# Altium schematic sheet DASH_CONNECTORS.SchDoc
size A
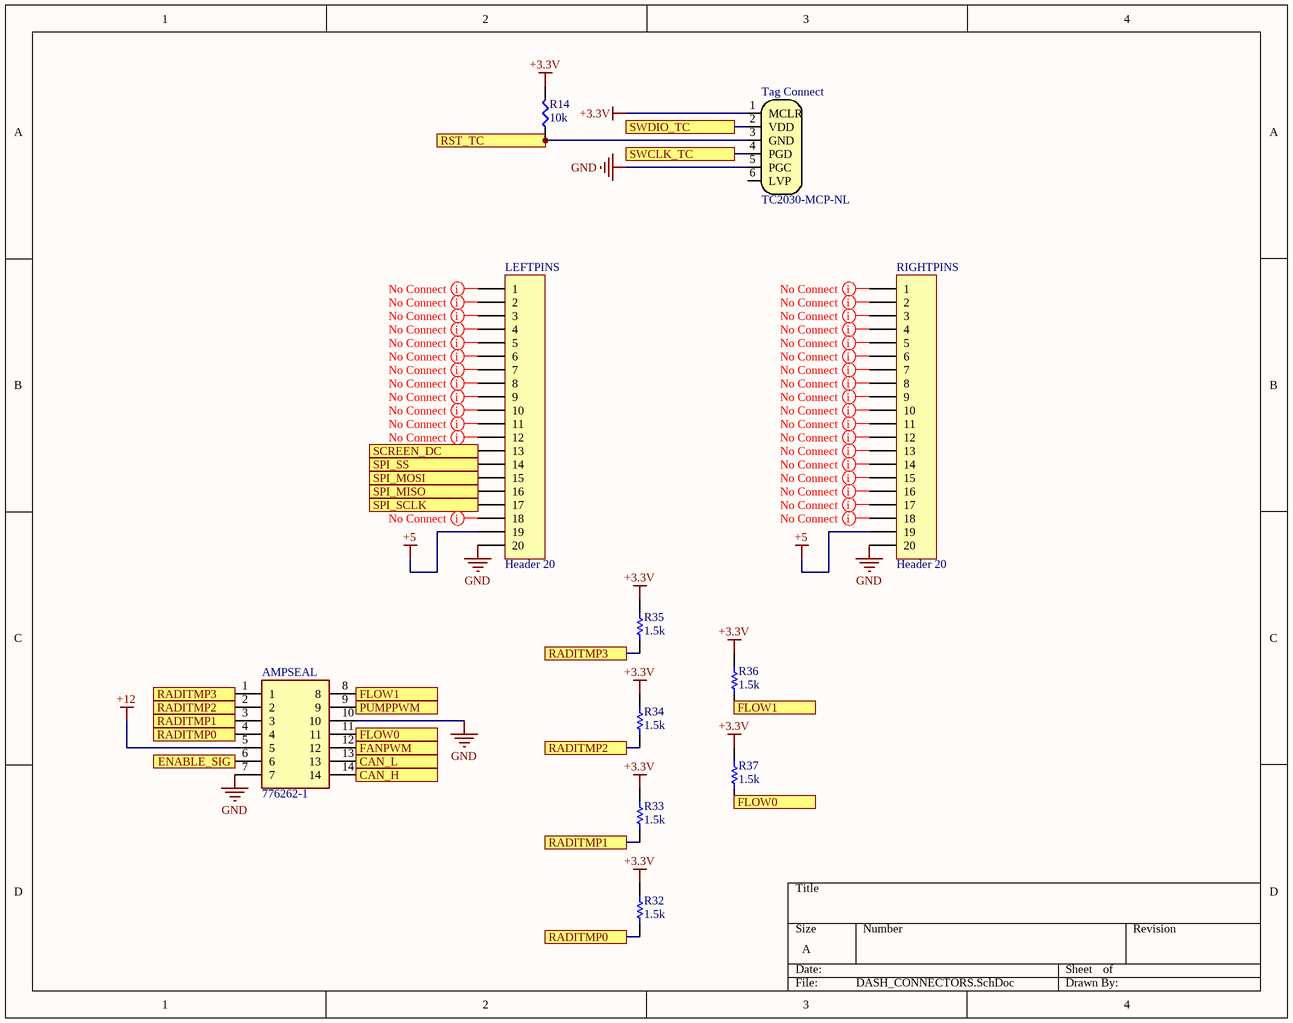
[diagram p0: DASH_CONNECTORS.SchDoc]

## Parts
AMPSEAL  776262-1  [7762621]
LEFTPINS  Header 20  [HDR1X20]
R14  10k  [RES-0603]
R32  1.5k  [RESC1608X55X30ML15T15]
R33  1.5k  [RESC1608X55X30ML15T15]
R34  1.5k  [RESC1608X55X30ML15T15]
R35  1.5k  [RESC1608X55X30ML15T15]
R36  1.5k  [RESC1608X55X30ML15T15]
R37  1.5k  [RESC1608X55X30ML15T15]
RIGHTPINS  Header 20  [HDR1X20]
Tag_Connect  TC2030-MCP-NL  [TC2030-MCP-NL]  (no BOM)

## Ports
CAN_H, CAN_L, ENABLE_SIG, FANPWM, FLOW0, FLOW1, PUMPPWM, RADITMP0, RADITMP1, RADITMP2, RADITMP3, RST_TC, SCREEN_DC, SPI_MISO, SPI_MOSI, SPI_SCLK, SPI_SS, SWCLK_TC, SWDIO_TC

## Nets
+3.3V: R14.2 R32.2 R33.2 R34.2 R35.2 R36.2 R37.2 Tag_Connect.1(MCLR)
+5: LEFTPINS.19 RIGHTPINS.19
+12: AMPSEAL.5
GND: AMPSEAL.7 AMPSEAL.10 LEFTPINS.20 RIGHTPINS.20 Tag_Connect.5(PGC)
CAN_H: AMPSEAL.14 ; port CAN_H
CAN_L: AMPSEAL.13 ; port CAN_L
ENABLE_SIG: AMPSEAL.6 ; port ENABLE_SIG
FANPWM: AMPSEAL.12 ; port FANPWM
FLOW0: AMPSEAL.11 R37.1 ; port FLOW0
FLOW1: AMPSEAL.8 R36.1 ; port FLOW1
PUMPPWM: AMPSEAL.9 ; port PUMPPWM
RADITMP0: AMPSEAL.4 R32.1 ; port RADITMP0
RADITMP1: AMPSEAL.3 R33.1 ; port RADITMP1
RADITMP2: AMPSEAL.2 R34.1 ; port RADITMP2
RADITMP3: AMPSEAL.1 R35.1 ; port RADITMP3
RST_TC: R14.1 Tag_Connect.3(GND) ; port RST_TC
SCREEN_DC: LEFTPINS.13 ; port SCREEN_DC
SPI_MISO: LEFTPINS.16 ; port SPI_MISO
SPI_MOSI: LEFTPINS.15 ; port SPI_MOSI
SPI_SCLK: LEFTPINS.17 ; port SPI_SCLK
SPI_SS: LEFTPINS.14 ; port SPI_SS
SWCLK_TC: Tag_Connect.4(PGD) ; port SWCLK_TC
SWDIO_TC: Tag_Connect.2(VDD) ; port SWDIO_TC

Not connected (* = marked no-connect by the designer): LEFTPINS 1 2 3 4 5 6 7 8 9 10 11 12 18; RIGHTPINS 1 2 3 4 5 6 7 8 9 10 11 12 13 14 15 16 17 18; Tag_Connect 6(LVP)

## Layout directives
mark named No Connect: NetLEFTPINS_1, NetLEFTPINS_2, NetLEFTPINS_3, NetLEFTPINS_4, NetLEFTPINS_5, NetLEFTPINS_6, NetLEFTPINS_7, NetLEFTPINS_8, NetLEFTPINS_9, NetLEFTPINS_10, NetLEFTPINS_11, NetLEFTPINS_12, NetLEFTPINS_18, NetRIGHTPINS_1, NetRIGHTPINS_2, NetRIGHTPINS_3, NetRIGHTPINS_4, NetRIGHTPINS_5, NetRIGHTPINS_6, NetRIGHTPINS_7, NetRIGHTPINS_8, NetRIGHTPINS_9, NetRIGHTPINS_10, NetRIGHTPINS_11, NetRIGHTPINS_12, NetRIGHTPINS_13, NetRIGHTPINS_14, NetRIGHTPINS_15, NetRIGHTPINS_16, NetRIGHTPINS_17, NetRIGHTPINS_18

## Library data of the parts
AMPSEAL = 776262-1: Connector; Manufacturer_Name: TE Connectivity; Datasheet Link: http://www.te.com/commerce/DocumentDelivery/DDEController?Action=showdoc&DocId=Customer+Drawing%7F776262%7FA8%7Fpdf%7FEnglish%7FENG_CD_776262_A8.pdf%7F776262-1; Height: 34mm; Manufacturer_Part_Number: 776262-1; Mouser Part Number: 571-776262-1; Mouser Price/Stock: https://www.mouser.co.uk/ProductDetail/TE-Connectivity-AMP/776262-1?qs=tLAa1RwIH6f%2FfrCrHR1d%252Bw%3D%3D; Arrow Part Number: 776262-1; Arrow Price/Stock: https://www.arrow.com/en/products/776262-1/te-connectivity
LEFTPINS RIGHTPINS = Header 20: Header, 20-Pin; LatestRevisionDate: 17-Jul-2002; LatestRevisionNote: Re-released for DXP Platform.; Publisher: Altium Limited
R14 = RES-0603
R32-R37 = CMP-1012-00528-2: Part Number: ERJ-3EKF1501V; Manufacturer: Panasonic
Tag_Connect = CMP-003-000769-1: Conector par ICD; Design Item ID: TC2030-MCP-NL; Source: Image Pasted at 2021-10-31 17-08.SchLib